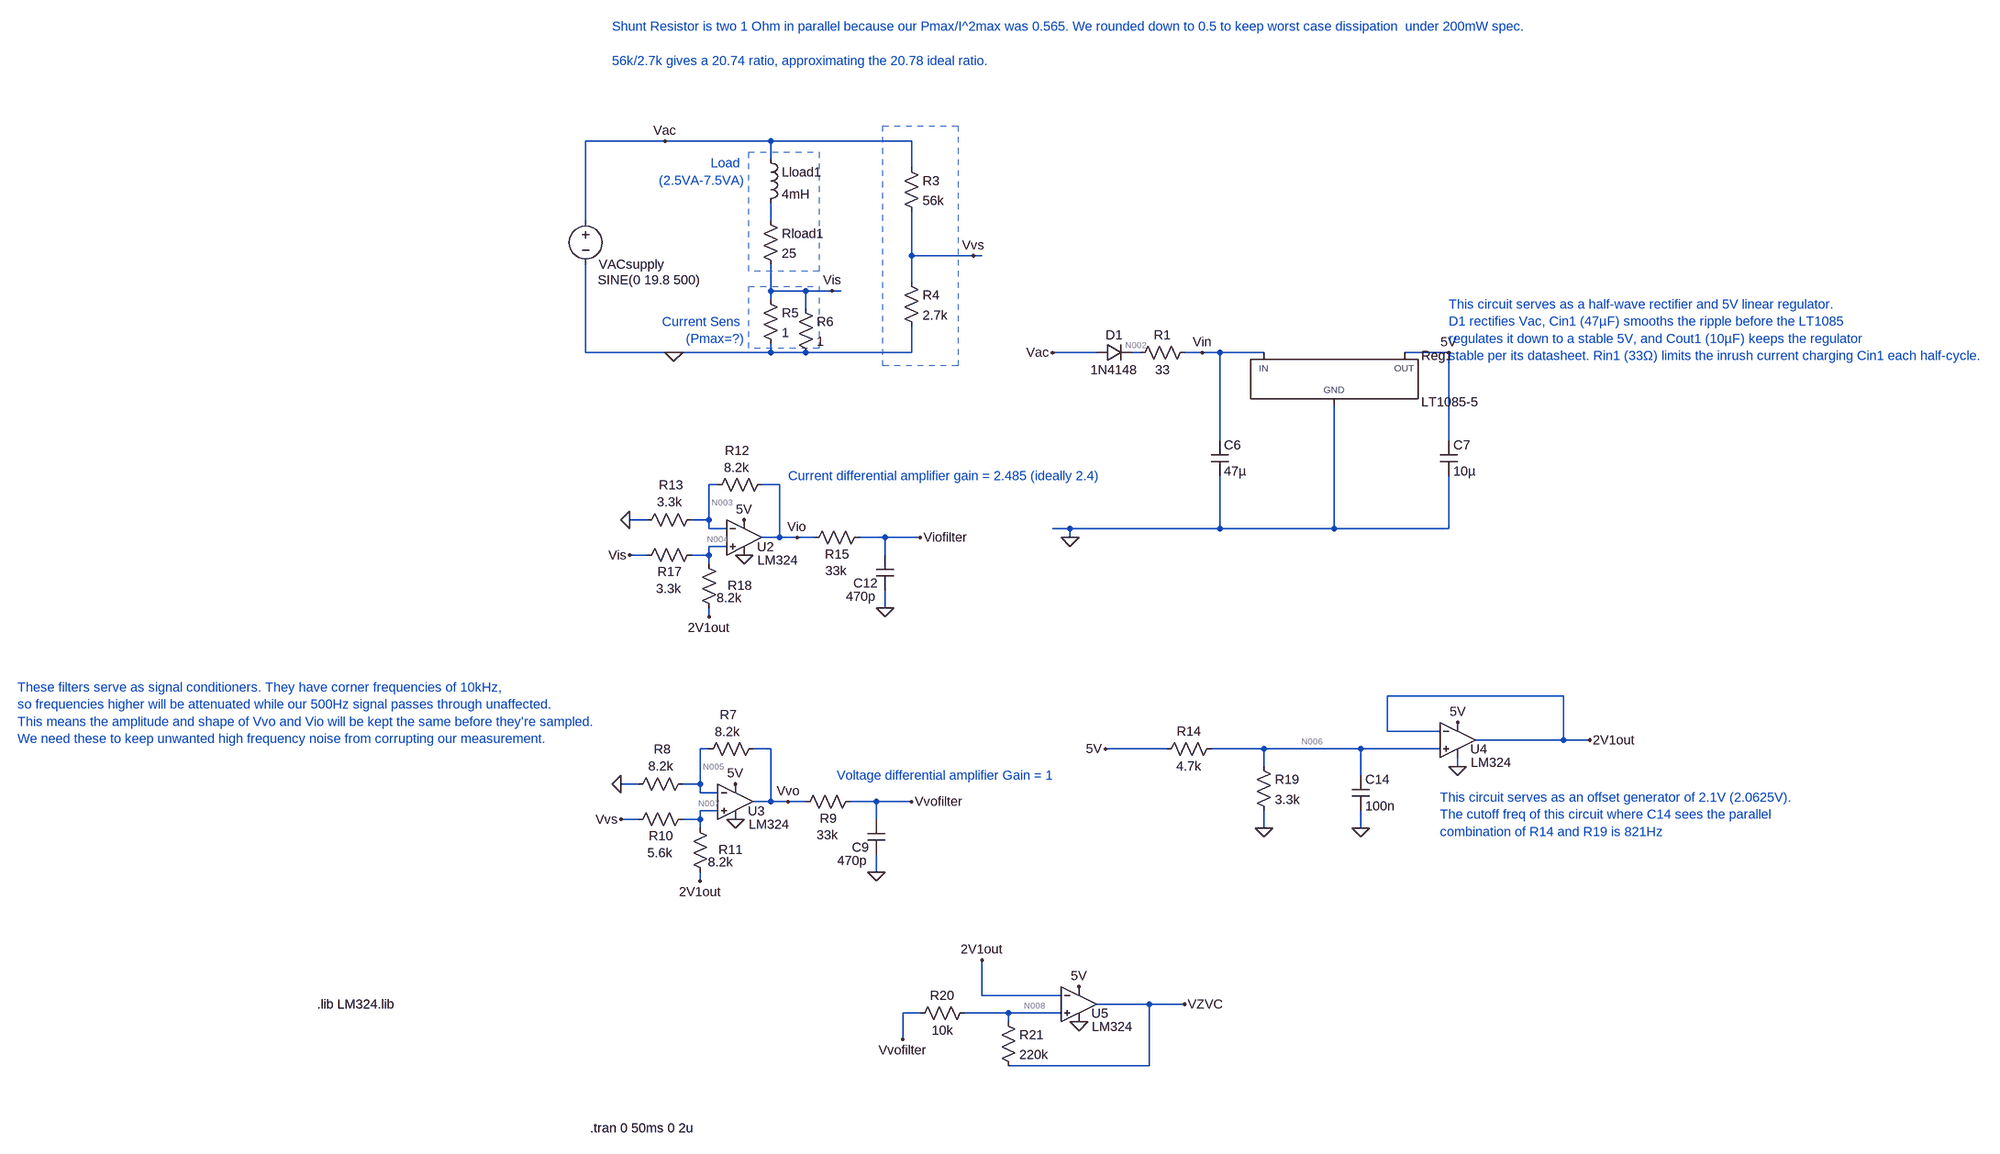
[diagram p0: schematic AnalogDesign.asc]
AnalogDesign.asc, the LTspice schematic file:
Version 4.1
SHEET 1 7972 2980
WIRE 2528 320 2384 320
WIRE 2720 320 2528 320
WIRE 2976 320 2720 320
WIRE 2720 352 2720 320
WIRE 2976 368 2976 320
WIRE 2384 464 2384 320
WIRE 2720 464 2720 432
WIRE 2976 528 2976 448
WIRE 3088 528 2976 528
WIRE 3104 528 3088 528
WIRE 2976 576 2976 528
WIRE 2720 592 2720 544
WIRE 2784 592 2720 592
WIRE 2832 592 2784 592
WIRE 2848 592 2832 592
WIRE 2720 608 2720 592
WIRE 2784 624 2784 592
WIRE 2384 704 2384 544
WIRE 2544 704 2384 704
WIRE 2720 704 2720 688
WIRE 2720 704 2544 704
WIRE 2784 704 2720 704
WIRE 2976 704 2976 656
WIRE 2976 704 2784 704
WIRE 3312 704 3232 704
WIRE 3392 704 3376 704
WIRE 3504 704 3472 704
WIRE 3536 704 3504 704
WIRE 3616 704 3536 704
WIRE 3952 704 3872 704
WIRE 3536 864 3536 704
WIRE 3952 864 3952 704
WIRE 2624 944 2608 944
WIRE 2736 944 2704 944
WIRE 2496 1008 2464 1008
WIRE 2608 1008 2608 944
WIRE 2608 1008 2576 1008
WIRE 2608 1024 2608 1008
WIRE 2640 1024 2608 1024
WIRE 3264 1024 3232 1024
WIRE 3536 1024 3536 928
WIRE 3536 1024 3264 1024
WIRE 3744 1024 3744 800
WIRE 3744 1024 3536 1024
WIRE 3952 1024 3952 928
WIRE 3952 1024 3744 1024
WIRE 2736 1040 2736 944
WIRE 2736 1040 2704 1040
WIRE 2768 1040 2736 1040
WIRE 2800 1040 2768 1040
WIRE 2928 1040 2880 1040
WIRE 2992 1040 2928 1040
WIRE 3264 1040 3264 1024
WIRE 2640 1056 2608 1056
WIRE 2496 1072 2464 1072
WIRE 2608 1072 2608 1056
WIRE 2608 1072 2576 1072
WIRE 2928 1072 2928 1040
WIRE 2608 1088 2608 1072
WIRE 2928 1168 2928 1136
WIRE 2608 1184 2608 1168
WIRE 4160 1328 3840 1328
WIRE 3840 1392 3840 1328
WIRE 3936 1392 3840 1392
WIRE 4160 1408 4160 1328
WIRE 4160 1408 4000 1408
WIRE 4208 1408 4160 1408
WIRE 2608 1424 2592 1424
WIRE 2720 1424 2688 1424
WIRE 3440 1424 3328 1424
WIRE 3616 1424 3520 1424
WIRE 3792 1424 3616 1424
WIRE 3936 1424 3792 1424
WIRE 3616 1456 3616 1424
WIRE 3968 1456 3968 1440
WIRE 3792 1472 3792 1424
WIRE 2480 1488 2448 1488
WIRE 2592 1488 2592 1424
WIRE 2592 1488 2560 1488
WIRE 2592 1504 2592 1488
WIRE 2624 1504 2592 1504
WIRE 2720 1520 2720 1424
WIRE 2720 1520 2688 1520
WIRE 2752 1520 2720 1520
WIRE 2784 1520 2752 1520
WIRE 2912 1520 2864 1520
WIRE 2976 1520 2912 1520
WIRE 2624 1536 2592 1536
WIRE 2480 1552 2448 1552
WIRE 2592 1552 2592 1536
WIRE 2592 1552 2560 1552
WIRE 2912 1552 2912 1520
WIRE 2592 1568 2592 1552
WIRE 3616 1568 3616 1536
WIRE 3792 1568 3792 1536
WIRE 2912 1648 2912 1616
WIRE 2592 1664 2592 1648
WIRE 3104 1872 3104 1808
WIRE 3248 1872 3104 1872
WIRE 3408 1888 3312 1888
WIRE 3472 1888 3408 1888
WIRE 2992 1904 2960 1904
WIRE 3152 1904 3072 1904
WIRE 3248 1904 3152 1904
WIRE 3152 1920 3152 1904
WIRE 2960 1952 2960 1904
WIRE 3408 2000 3408 1888
WIRE 3408 2000 3152 2000
FLAG 2672 1072 0
FLAG 2672 1008 5V
FLAG 2464 1072 Vis
FLAG 2464 1008 0
FLAG 2768 1040 Vio
FLAG 2608 1184 2V1out
FLAG 3616 1568 0
FLAG 3792 1568 0
FLAG 4208 1408 2V1out
FLAG 3968 1456 0
FLAG 3968 1376 5V
FLAG 2928 1168 0
FLAG 2992 1040 Viofilter
FLAG 2656 1552 0
FLAG 2656 1488 5V
FLAG 2448 1552 Vvs
FLAG 2448 1488 0
FLAG 2752 1520 Vvo
FLAG 2592 1664 2V1out
FLAG 2912 1648 0
FLAG 2976 1520 Vvofilter
FLAG 3264 1040 0
FLAG 3232 704 Vac
FLAG 3504 704 Vin
FLAG 3952 704 5V
FLAG 3328 1424 5V
FLAG 2544 704 0
FLAG 2528 320 Vac
FLAG 2832 592 Vis
FLAG 3088 528 Vvs
FLAG 3280 1856 5V
FLAG 3280 1920 0
FLAG 3472 1888 VZVC
FLAG 2960 1952 Vvofilter
FLAG 3104 1808 2V1out
SYMBOL Opamps/opamp2 2672 976 R0
WINDOW 0 23 81 Left 2
WINDOW 3 24 105 Left 2
SYMATTR InstName U2
SYMATTR Value LM324
SYMBOL res 2592 1056 R90
WINDOW 0 62 55 VBottom 2
WINDOW 3 61 57 VTop 2
SYMATTR InstName R17
SYMATTR Value 3.3k
SYMBOL res 2592 992 R90
WINDOW 0 -32 53 VBottom 2
WINDOW 3 -32 55 VTop 2
SYMATTR InstName R13
SYMATTR Value 3.3k
SYMBOL res 2720 928 R90
WINDOW 0 -30 61 VBottom 2
WINDOW 3 -31 62 VTop 2
SYMATTR InstName R12
SYMATTR Value 8.2k
SYMBOL res 2624 1184 R180
WINDOW 0 -62 57 Left 2
WINDOW 3 -44 34 Left 2
SYMATTR InstName R18
SYMATTR Value 8.2k
SYMBOL res 3536 1408 R90
WINDOW 0 0 56 VBottom 2
WINDOW 3 32 56 VTop 2
SYMATTR InstName R14
SYMATTR Value 4.7k
SYMBOL res 3600 1440 R0
SYMATTR InstName R19
SYMATTR Value 3.3k
SYMBOL cap 3776 1472 R0
SYMATTR InstName C14
SYMATTR Value 100n
SYMBOL Opamps/opamp2 3968 1344 R0
WINDOW 0 23 81 Left 2
WINDOW 3 24 105 Left 2
SYMATTR InstName U4
SYMATTR Value LM324
SYMBOL res 2896 1024 R90
WINDOW 0 62 55 VBottom 2
WINDOW 3 61 57 VTop 2
SYMATTR InstName R15
SYMATTR Value 33k
SYMBOL cap 2944 1136 R180
WINDOW 0 29 13 Left 2
WINDOW 3 33 -11 Left 2
SYMATTR InstName C12
SYMATTR Value 470p
SYMBOL Opamps/opamp2 2656 1456 R0
WINDOW 0 23 81 Left 2
WINDOW 3 24 105 Left 2
SYMATTR InstName U3
SYMATTR Value LM324
SYMBOL res 2576 1536 R90
WINDOW 0 62 55 VBottom 2
WINDOW 3 61 57 VTop 2
SYMATTR InstName R10
SYMATTR Value 5.6k
SYMBOL res 2576 1472 R90
WINDOW 0 -32 53 VBottom 2
WINDOW 3 -32 55 VTop 2
SYMATTR InstName R8
SYMATTR Value 8.2k
SYMBOL res 2704 1408 R90
WINDOW 0 -30 61 VBottom 2
WINDOW 3 -31 62 VTop 2
SYMATTR InstName R7
SYMATTR Value 8.2k
SYMBOL res 2608 1664 R180
WINDOW 0 -62 57 Left 2
WINDOW 3 -44 34 Left 2
SYMATTR InstName R11
SYMATTR Value 8.2k
SYMBOL res 2880 1504 R90
WINDOW 0 62 55 VBottom 2
WINDOW 3 61 57 VTop 2
SYMATTR InstName R9
SYMATTR Value 33k
SYMBOL cap 2928 1616 R180
WINDOW 0 29 13 Left 2
WINDOW 3 33 -11 Left 2
SYMATTR InstName C9
SYMATTR Value 470p
SYMBOL PowerProducts/LT1085-5 3744 704 R0
SYMATTR InstName Reg1
SYMBOL res 3488 688 R90
WINDOW 0 0 56 VBottom 2
WINDOW 3 32 56 VTop 2
SYMATTR InstName R1
SYMATTR Value 33
SYMBOL diode 3312 720 R270
WINDOW 0 32 32 VTop 2
WINDOW 3 0 32 VBottom 2
SYMATTR InstName D1
SYMATTR Value 1N4148
SYMBOL cap 3520 864 R0
SYMATTR InstName C6
SYMATTR Value 47µ
SYMATTR SpiceLine Rser=0.001
SYMBOL cap 3936 864 R0
SYMATTR InstName C7
SYMATTR Value 10µ
SYMATTR SpiceLine Rser=0.001
SYMBOL voltage 2384 448 R0
WINDOW 0 24 96 Left 2
WINDOW 3 22 124 Left 2
WINDOW 123 0 0 Left 0
WINDOW 39 0 0 Left 0
SYMATTR InstName VACsupply
SYMATTR Value SINE(0 19.8 500)
SYMBOL res 2704 448 R0
SYMATTR InstName Rload1
SYMATTR Value 25
SYMBOL ind 2704 336 R0
SYMATTR InstName Lload1
SYMATTR Value 4mH
SYMBOL res 2704 592 R0
SYMATTR InstName R5
SYMATTR Value 1
SYMBOL res 2960 352 R0
SYMATTR InstName R3
SYMATTR Value 56k
SYMBOL res 2960 560 R0
SYMATTR InstName R4
SYMATTR Value 2.7k
SYMBOL Opamps/opamp2 3280 1824 R0
WINDOW 0 23 81 Left 2
WINDOW 3 24 105 Left 2
SYMATTR InstName U5
SYMATTR Value LM324
SYMBOL res 2768 608 R0
SYMATTR InstName R6
SYMATTR Value 1
SYMBOL res 3136 1904 R0
SYMATTR InstName R21
SYMATTR Value 220k
SYMBOL res 3088 1888 R90
WINDOW 0 0 56 VBottom 2
WINDOW 3 32 56 VTop 2
SYMATTR InstName R20
SYMATTR Value 10k
TEXT 2672 360 Right 2 ;Load \n(2.5VA-7.5VA)
TEXT 2672 648 Right 2 ;Current Sens \n(Pmax=?)
TEXT 2392 2216 Left 2 !.tran 0 50ms 0 2u
TEXT 1896 1888 Left 2 !.lib LM324.lib
TEXT 3936 1512 Left 2 ;This circuit serves as an offset generator of 2.1V (2.0625V). \nThe cutoff freq of this circuit where C14 sees the parallel \ncombination of R14 and R19 is 821Hz
TEXT 1352 1312 Left 2 ;These filters serve as signal conditioners. They have corner frequencies of 10kHz, \nso frequencies higher will be attenuated while our 500Hz signal passes through unaffected.\nThis means the amplitude and shape of Vvo and Vio will be kept the same before they're sampled.\nWe need these to keep unwanted high frequency noise from corrupting our measurement.
TEXT 2432 96 Left 2 ;Shunt Resistor is two 1 Ohm in parallel because our Pmax/I^2max was 0.565. We rounded down to 0.5 to keep worst case dissipation  under 200mW spec. \n \n56k/2.7k gives a 20.74 ratio, approximating the 20.78 ideal ratio.
TEXT 2840 1472 Left 2 ;Voltage differential amplifier Gain = 1
TEXT 2752 928 Left 2 ;Current differential amplifier gain = 2.485 (ideally 2.4)
TEXT 3952 616 Left 2 ;This circuit serves as a half-wave rectifier and 5V linear regulator. \nD1 rectifies Vac, Cin1 (47µF) smooths the ripple before the LT1085 \nregulates it down to a stable 5V, and Cout1 (10µF) keeps the regulator \nstable per its datasheet. Rin1 (33Ω) limits the inrush current charging Cin1 each half-cycle.
RECTANGLE Normal 2680 340 2808 556 2
RECTANGLE Normal 2680 584 2808 696 2
RECTANGLE Normal 2924 292 3060 728 2

The netlist it stands for:
* AnalogDesign.asc
X§U2 N004 N003 5V 0 Vio LM324  ; pins In+ In- V+ V- OUT
R17 N004 Vis 3.3k
R13 N003 0 3.3k
R12 Vio N003 8.2k
R18 2V1out N004 8.2k
R14 N006 5V 4.7k
R19 N006 0 3.3k
C14 N006 0 100n
X§U4 N006 2V1out 5V 0 2V1out LM324  ; pins In+ In- V+ V- OUT
R15 Viofilter Vio 33k
C12 0 Viofilter 470p
X§U3 N007 N005 5V 0 Vvo LM324  ; pins In+ In- V+ V- OUT
R10 N007 Vvs 5.6k
R8 N005 0 8.2k
R7 Vvo N005 8.2k
R11 2V1out N007 8.2k
R9 Vvofilter Vvo 33k
C9 0 Vvofilter 470p
X§Reg1 0 5V Vin LT1085-5  ; pins GND OUT IN
R1 Vin N002 33
D1 Vac N002 1N4148
C6 Vin 0 47µ Rser=0.001
C7 5V 0 10µ Rser=0.001
VACsupply Vac 0 SINE(0 19.8 500)
Rload1 N001 Vis 25
Lload1 Vac N001 4mH
R5 Vis 0 1
R3 Vac Vvs 56k
R4 Vvs 0 2.7k
X§U5 N008 2V1out 5V 0 VZVC LM324  ; pins In+ In- V+ V- OUT
R6 Vis 0 1
R21 N008 VZVC 220k
R20 N008 Vvofilter 10k
.model D D
.lib standard.dio
* Load
* (2.5VA-7.5VA)
* Current Sens
* (Pmax=?)
.tran 0 50ms 0 2u
.lib LM324.lib
* This circuit serves as an offset generator of 2.1V (2.0625V).
* The cutoff freq of this circuit where C14 sees the parallel
* combination of R14 and R19 is 821Hz
* These filters serve as signal conditioners. They have corner frequencies of 10kHz,
* so frequencies higher will be attenuated while our 500Hz signal passes through unaffected.
* This means the amplitude and shape of Vvo and Vio will be kept the same before they're sampled.
* We need these to keep unwanted high frequency noise from corrupting our measurement.
* Shunt Resistor is two 1 Ohm in parallel because our Pmax/I^2max was 0.565. We rounded down to 0.5 to keep worst case dissipation  under 200mW spec.
* 56k/2.7k gives a 20.74 ratio, approximating the 20.78 ideal ratio.
* Voltage differential amplifier Gain = 1
* Current differential amplifier gain = 2.485 (ideally 2.4)
* This circuit serves as a half-wave rectifier and 5V linear regulator.
* D1 rectifies Vac, Cin1 (47µF) smooths the ripple before the LT1085
* regulates it down to a stable 5V, and Cout1 (10µF) keeps the regulator
* stable per its datasheet. Rin1 (33Ω) limits the inrush current charging Cin1 each half-cycle.
.backanno
.end

* Results of the author's LTspice run, read from the files saved beside the schematic
* Operating Point, zero values left out:
*   V(2v1out) = -98.35 mV
*   V(5v) = 1.303 V
*   V(n002) = 1.299 V
*   V(n003) = -28.24 mV
*   V(n004) = -28.18 mV
*   V(n005) = -49.21 mV
*   V(n006) = 537.4 mV
*   V(n007) = -49.02 mV
*   V(n008) = -97.87 mV
*   V(vin) = 1.299 V
*   V(vio) = -98.59 mV
*   V(viofilter) = -98.59 mV
*   V(vis) = -4.185 µV
*   V(vvo) = -98.59 mV
*   V(vvofilter) = -98.04 mV
*   V(vvs) = -15.44 mV
*   V(vzvc) = -98.59 mV
*   I(D1) = -2.521 nA
*   I(Lload1) = 167.4 nA
*   I(R1) = 2.521 nA
*   I(R10) = -5.996 µA
*   I(R11) = -6.016 µA
*   I(R12) = -8.579 µA
*   I(R13) = -8.559 µA
*   I(R14) = -162.9 µA
*   I(R17) = -8.538 µA
*   I(R18) = -8.558 µA
*   I(R19) = 162.9 µA
*   I(R20) = 16.65 nA
*   I(R21) = 3.25 nA
*   I(R3) = 275.8 nA
*   I(R4) = -5.72 µA
*   I(R5) = -4.185 µA
*   I(R6) = -4.185 µA
*   I(R7) = -6.022 µA
*   I(R8) = -6.002 µA
*   I(R9) = 16.65 nA
*   I(Rload1) = 167.4 nA
*   I(VACsupply) = -440.7 nA
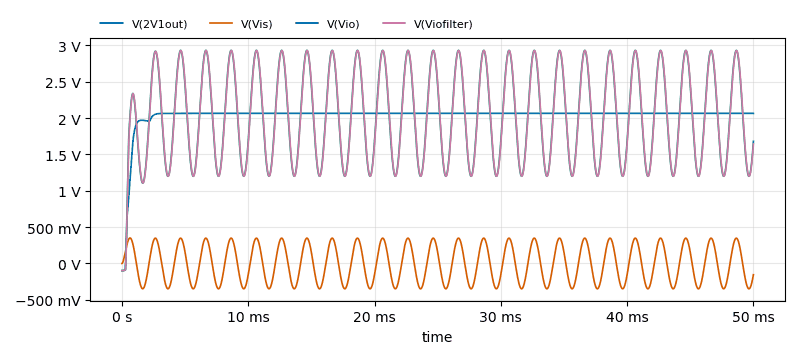
[diagram p1: Transient Analysis of AnalogDesign.asc, plotted from the saved traces]
* Transient Analysis, 1 run:
*   V(2V1out): min -98.35 mV, max 2.064 V, average 2.035 V, rms 2.045 V, last 2.064 V
*   V(Vis): min -348.1 mV, max 350.8 mV, average 569.6 µV, rms 246.3 mV, last -153.8 mV
*   V(Vio): min -98.59 mV, max 2.93 V, average 2.034 V, rms 2.131 V, last 1.68 V
*   V(Viofilter): min -98.59 mV, max 2.929 V, average 2.033 V, rms 2.13 V, last 1.643 V